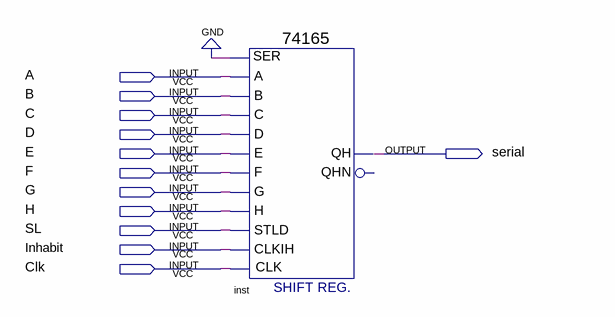
[diagram p0: schematic sheet]
// Quartus schematic serial.bdf as structural Verilog: 1 symbols, 12 pins
module serial (
  input  A,
  input  B,
  input  C,
  input  D,
  input  E,
  input  F,
  input  G,
  input  H,
  input  SL,
  input  Inhabit,
  input  Clk,
  output serial
);

  \74165  inst (
    .D(D), .C(C), .B(B), .G(G), .H(H), .A(A), .CLKIH(Inhabit), .E(E), .F(F), .CLK(Clk), .STLD(SL),
    .SER(1'b0), .QH(serial));  // open: QHN
endmodule
